# Altium schematic sheet 6_upstream_con.SchDoc
size A
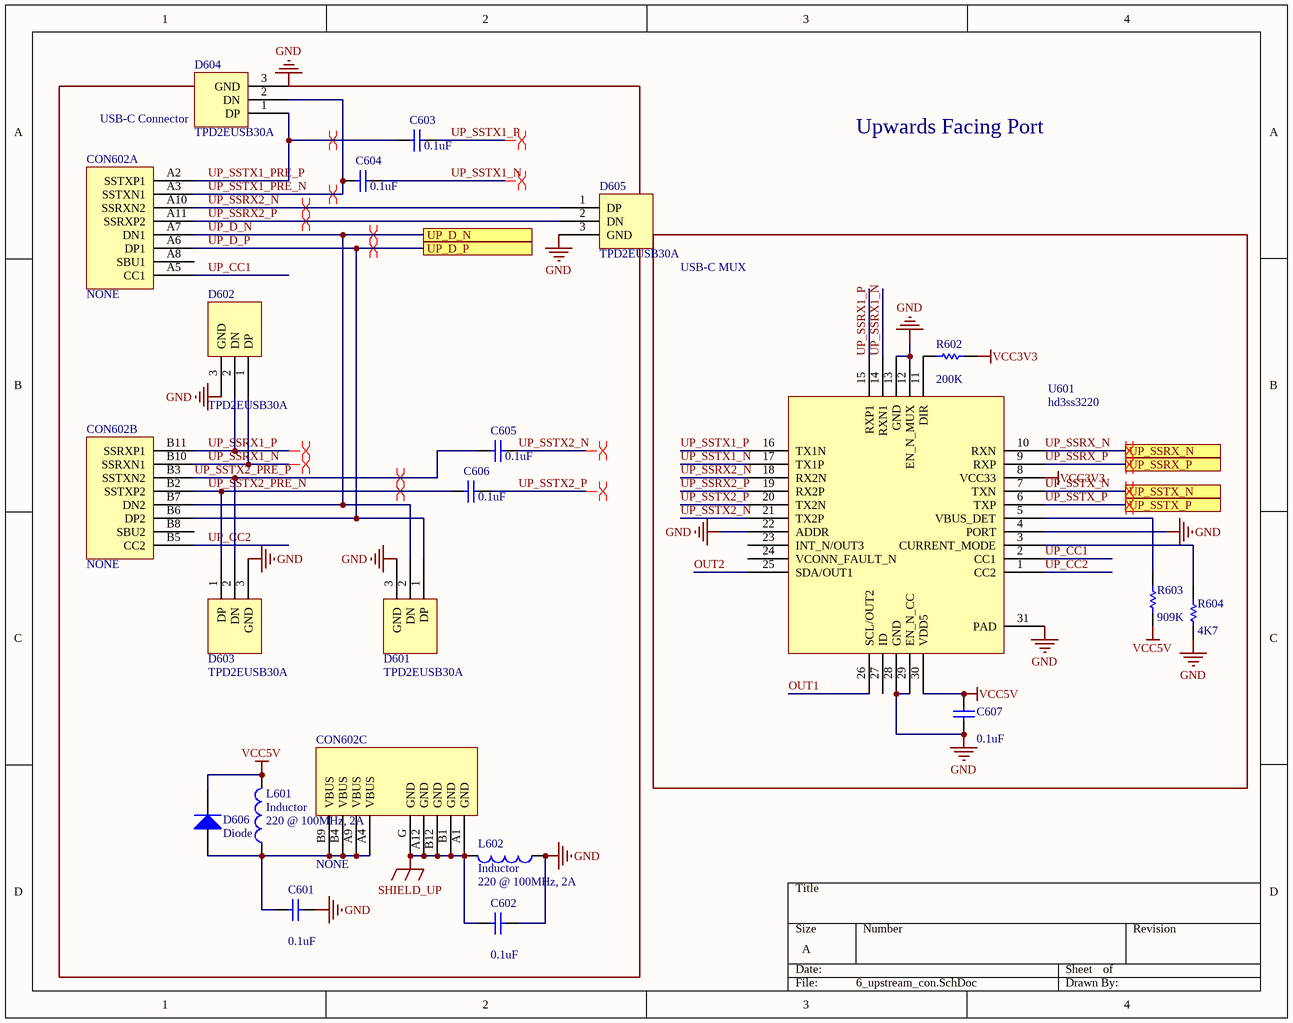
[diagram p0: 6_upstream_con.SchDoc]

## Parts
C601  value 0.1uF  [C0603[1608]]
C602  value 0.1uF  [C0603[1608]]  (no BOM)
C603  value 0.1uF  [C0402[1005]]
C604  value 0.1uF  [C0402[1005]]
C605  value 0.1uF  [C0402[1005]]
C606  value 0.1uF  [C0402[1005]]
C607  value 0.1uF  [C0603[1608]]
CON602  JLC: NONE  [XKB USB-C u262-241n-4bv64]  (hidden comment: for up to 1.6mm pcb)  (parts A,B,C of 3)
D601  TPD2EUSB30A  [TPD2EUSB30A]
D602  TPD2EUSB30A  [TPD2EUSB30A]
D603  TPD2EUSB30A  [TPD2EUSB30A]
D604  TPD2EUSB30A  [TPD2EUSB30A]
D605  TPD2EUSB30A  [TPD2EUSB30A]
D606  Diode  [LED0603[1608]]  (no BOM)
L601  Inductor  value 220 @ 100MHz, 2A  [L0603[1608]]
L602  Inductor  value 220 @ 100MHz, 2A  [L0603[1608]]
R602  value 200K  [R0603[1608]]
R603  value 909K  [R0603[1608]]
R604  value 4K7  [R0603[1608]]
U601  hd3ss3220  [hd3ss3220]

## Blocks framed on the sheet
USB-C Connector: C601-C606 CON602 D601-D606 L601 L602
USB-C MUX: C607 R602-R604 U601

## Ports
UP_D_N, UP_D_P, UP_SSRX_N, UP_SSRX_P, UP_SSTX_N, UP_SSTX_P

## Nets
GND: C601.1 C602.1 C607.1 D601.3(GND) D602.3(GND) D603.3(GND) D604.3(GND) D605.3(GND) L602.1 R604.2 U601.4(PORT) U601.12(EN_N_MUX) U601.13(GND) U601.22(ADDR) U601.28(GND) U601.29(EN_N_CC) U601.31(PAD)
SHIELD_UP: C602.2 CON602.A1(GND) CON602.A12(GND) CON602.B1(GND) CON602.B12(GND) CON602.G(GND) L602.2
VCC3V3: R602.2 U601.8(VCC33)
VCC5V: C607.2 D606.2(K) L601.2 R603.2 U601.30(VDD5)
OUT1: U601.26(SCL/OUT2)
OUT2: U601.25(SDA/OUT1)
UP_CC1: CON602.A5(CC1) U601.2(CC1)
UP_CC2: CON602.B5(CC2) U601.1(CC2)
UP_D_N: CON602.A7(DN1) CON602.B7(DN2) D601.2(DN) ; port UP_D_N
UP_D_P: CON602.A6(DP1) CON602.B6(DP2) D601.1(DP) ; port UP_D_P
UP_SSRX1_N: CON602.B10(SSRXN1) D602.1(DP) U601.14(RXN1)
UP_SSRX1_P: CON602.B11(SSRXP1) D602.2(DN) U601.15(RXP1)
UP_SSRX2_N: CON602.A10(SSRXN2) D605.1(DP) U601.18(RX2N)
UP_SSRX2_P: CON602.A11(SSRXP2) D605.2(DN) U601.19(RX2P)
UP_SSRX_N: U601.10(RXN) ; port UP_SSRX_N
UP_SSRX_P: U601.9(RXP) ; port UP_SSRX_P
UP_SSTX1_N: C604.2 U601.17(TX1P)
UP_SSTX1_P: C603.2 U601.16(TX1N)
UP_SSTX1_PRE_N: C604.1 CON602.A3(SSTXN1) D604.2(DN)
UP_SSTX1_PRE_P: C603.1 CON602.A2(SSTXP1) D604.1(DP)
UP_SSTX2_N: C605.2 U601.21(TX2P)
UP_SSTX2_P: C606.2 U601.20(TX2N)
UP_SSTX2_PRE_N: C606.1 CON602.B2(SSTXP2) D603.1(DP)
UP_SSTX2_PRE_P: C605.1 CON602.B3(SSTXN2) D603.2(DN)
UP_SSTX_N: U601.7(TXN) ; port UP_SSTX_N
UP_SSTX_P: U601.6(TXP) ; port UP_SSTX_P
NetC601_2: C601.2 CON602.A4(VBUS) CON602.A9(VBUS) CON602.B4(VBUS) CON602.B9(VBUS) D606.1(A) L601.1
NetR602_1: R602.1 U601.11(DIR)
NetR603_1: R603.1 U601.5(VBUS_DET)
NetR604_1: R604.1 U601.3(CURRENT_MODE)

Not connected (* = marked no-connect by the designer): CON602 A8(SBU1) B8(SBU2); U601 23(INT_N/OUT3) 24(VCONN_FAULT_N) 27(ID)

## Layout directives
differential pair: UP_D_N, UP_D_P, UP_SSRX1_N, UP_SSRX1_P, UP_SSRX2_N, UP_SSRX2_P, UP_SSRX_N, UP_SSRX_P, UP_SSTX1_N, UP_SSTX1_P, UP_SSTX1_PRE_N, UP_SSTX1_PRE_P, UP_SSTX2_N, UP_SSTX2_P, UP_SSTX2_PRE_N, UP_SSTX2_PRE_P, UP_SSTX_N, UP_SSTX_P

## Notes on the sheet
- Upwards Facing Port

## Library data of the parts
C601 C602 C607 = Cap: Capacitor; MRF.Part: CC0603KRX7R9BB104; MFG: KEMET; MFGPN: C0603C104M5RACTU; LCSC MFG: YAGEO; Version: 0603 imperial; JLC: BASIC; LCSC Part #: C14663
C603-C606 = Cap: Capacitor; MRF.Part: CL05B104KO5NNNC; MFG: KEMET; MFGPN: C0402C104K8PACTU; LCSC MFG: Samsung Electro-Mechanics; Version: 0402 imperial; JLC: BASIC; LCSC Part #: C1525
CON602 = XKB USB-C u262-241n-4bv64: LCSC MFG: XKB Connectivity; LCSC Part #: C388660; MRF.Part: U262-241N-4BV64
D601 = TPD2EUSB30A: MFG: Texas Instruments; MFGPN: TPD2EUSB30ADRTR; LCSC MFG: Texas Instruments; LCSC Part #: C94934; MRF.Part: TPD2EUSB30ADRTR; JLC: NONE
D602-D605 = TPD2EUSB30A: MFGPN: TPD2EUSB30ADRTR; MFG: Texas Instruments; LCSC MFG: Texas Instruments; LCSC Part #: C94934; MRF.Part: TPD2EUSB30ADRTR; JLC: NONE
D606 = Diode: Default Diode; MFG: Comchip Technology; Version: 0603 imperial; JLC: DNP
L601 L602 = Inductor: MRF.Part: BLM18KG331SN1D; MFG: Murata Electronics North America; MFGPN: BLM18KG221SN1D; LCSC MFG: Murata Electronics; Version: 0603 imperial; JLC: EXTENDED; LCSC Part #: C85832
R602 = Res1: Resistor; MRF.Part: 0603WAF2003T5E; MFG: Vishay Dale; MFGPN: CRCW0603200KFKEB; LCSC MFG: Uniroyal Elec; Version: 0603 imperial; JLC: BASIC; LCSC Part #: C25811
R603 = Res1: Resistor; MRF.Part: 0603WAF9093T5E; MFG: Vishay Dale; MFGPN: CRCW0603909KFKEA; LCSC MFG: Uniroyal Elec; Version: 0603 imperial; JLC: EXTENDED; LCSC Part #: C22935
R604 = Res1: Resistor; MRF.Part: 0603WAF4701T5E; MFG: Vishay Dale; MFGPN: RCA06034K70FKEA; LCSC MFG: Uniroyal Elec; Version: 0603 imperial; JLC: BASIC; LCSC Part #: C23162
U601 = hd3ss3220: MFG: Texas Instruments; MFGPN: HD3SS3220RNHR; JLC: NONE; LCSC MFG: Texas Instruments; LCSC Part #: C165155; MRF.Part: HD3SS3220RNHR